# Altium schematic sheet Converter.SchDoc
size A4; SheetNumber: 2; SheetTotal: 4
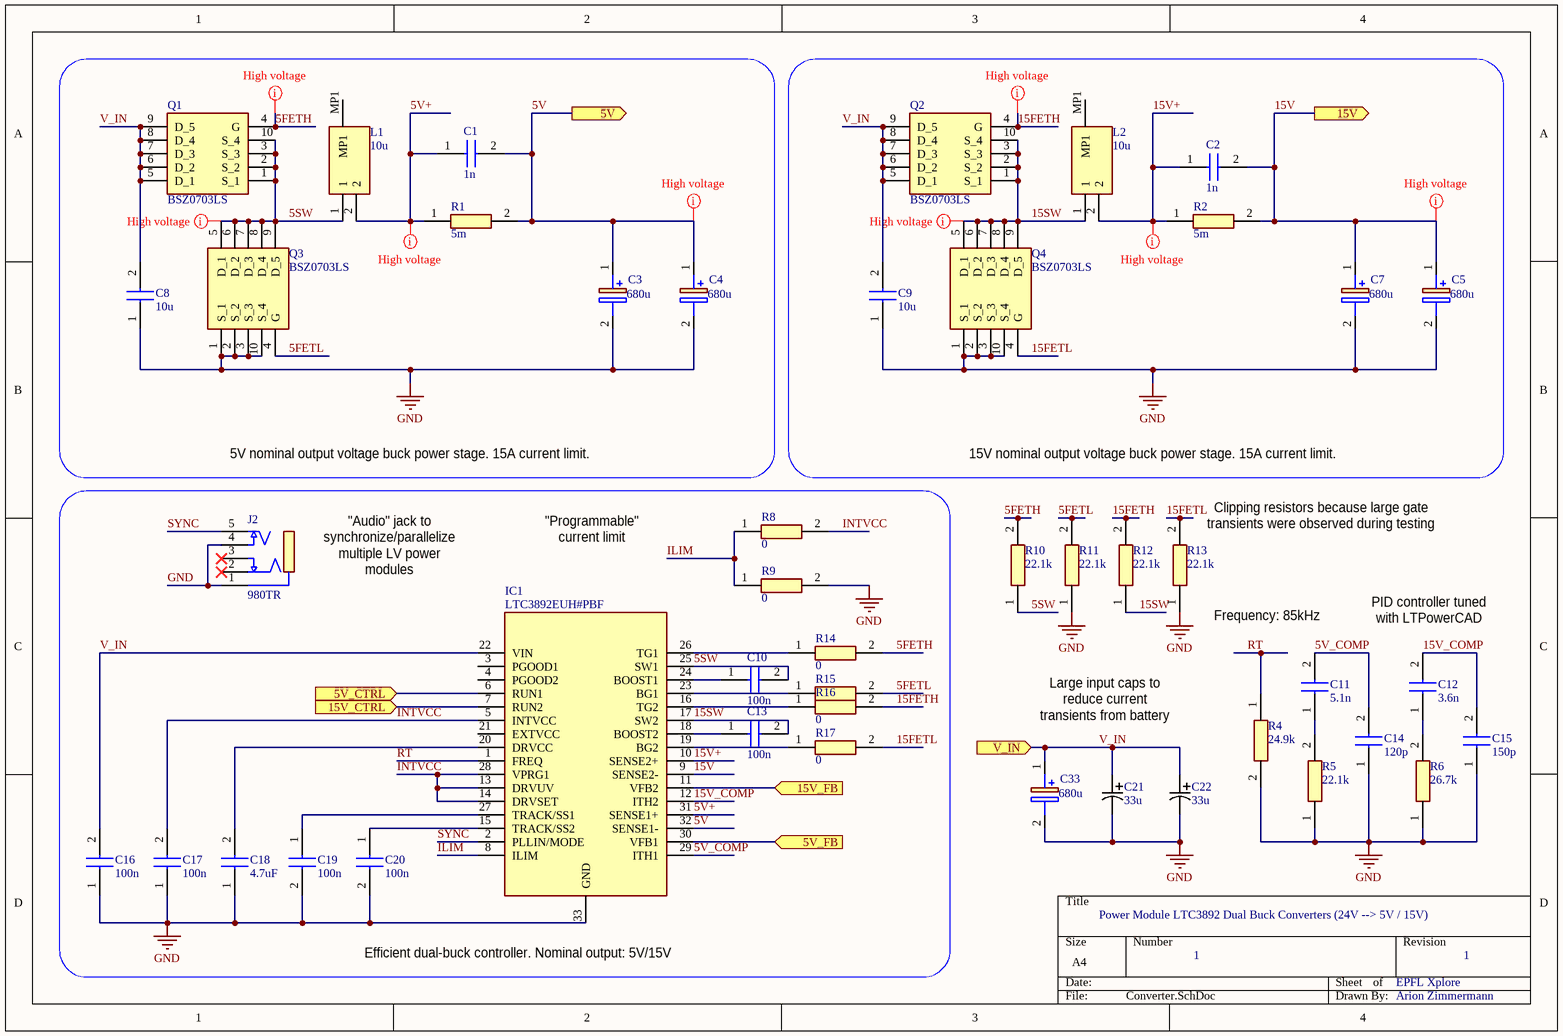
[diagram p0: Converter.SchDoc]

## Parts
C1  value 1n  [CAPC1608X95N]  (hidden comment: C0603C102J5RACTU)
C2  value 1n  [CAPC1608X95N]  (hidden comment: C0603C102J5RACTU)
C3  value 680u  [CAPPRD500W65D1000H1800]  (hidden comment: A750MW687M1VAAE018)
C4  value 680u  [CAPPRD500W65D1000H1800]  (hidden comment: A750MW687M1VAAE018)
C5  value 680u  [CAPPRD500W65D1000H1800]  (hidden comment: A750MW687M1VAAE018)
C7  value 680u  [CAPPRD500W65D1000H1800]  (hidden comment: A750MW687M1VAAE018)
C8  value 10u  [CAPC5750X310N]  (hidden comment: C5750X7S2A106K230KB)
C9  value 10u  [CAPC5750X310N]  (hidden comment: C5750X7S2A106K230KB)
C10  value 100n  [CAPC1608X95N]  (hidden comment: C0603C104K5RACTU)
C11  value 5.1n  [CAPC1608X87N]  (hidden comment: C0603C512J5GACAUTO)
C12  value 3.6n  [CAPC1608X87N]  (hidden comment: C0603C362J5GACTU)
C13  value 100n  [CAPC1608X95N]  (hidden comment: C0603C104K5RACTU)
C14  value 120p  [CAPC1608X87N]  (hidden comment: C0603C121J5GACTU)
C15  value 150p  [CAPC1608X87N]  (hidden comment: C0603C151J5GAC)
C16  value 100n  [CAPC1608X95N]  (hidden comment: C0603C104K5RACTU)
C17  value 100n  [CAPC1608X95N]  (hidden comment: C0603C104K5RACTU)
C18  value 4.7uF  [CAPC3316X195N]  (hidden comment: C1206X475M5RACAUTO)
C19  value 100n  [CAPC1608X95N]  (hidden comment: C0603C104K5RACTU)
C20  value 100n  [CAPC1608X95N]  (hidden comment: C0603C104K5RACTU)
C21  value 33u  [CAPMP7.6X4.3_3.1N_KEM]  (hidden comment: T598D336M035ATE065)
C22  value 33u  [CAPMP7.6X4.3_3.1N_KEM]  (hidden comment: T598D336M035ATE065)
C33  value 680u  [CAPPRD500W65D1000H1800]  (hidden comment: A750MW687M1VAAE018)
IC1  LTC3892EUH#PBF  [QFN50P500X500X80-33N-D]
J2  980TR  [980TR]
L1  value 10u  [PQ2614BLA1R0K]  (hidden comment: PQ2614BHA-100K)
L2  value 10u  [PQ2614BLA1R0K]  (hidden comment: PQ2614BHA-100K)
Q1  BSZ0703LS  [BSZ011NE2LS5IATMA1]
Q2  BSZ0703LS  [BSZ011NE2LS5IATMA1]
Q3  BSZ0703LS  [BSZ011NE2LS5IATMA1]
Q4  BSZ0703LS  [BSZ011NE2LS5IATMA1]
R1  value 5m  [RESC6432X80N]  (hidden comment: CRF2512-FZ-R005ELF)
R2  value 5m  [RESC6432X80N]  (hidden comment: CRF2512-FZ-R005ELF)
R4  value 24.9k  [RESC1608X50N]  (hidden comment: CRCW060324K9FKTA)
R5  value 22.1k  [RESC1608X50N]  (hidden comment: CRCW060322K1FKEB)
R6  value 26.7k  [RESC1608X50N]  (hidden comment: CRCW060326K7FKEB)
R8  Parameter 1: 0  [RESC1608X50N]  (hidden comment: CRCW06030000ZSTB)
R9  Parameter 1: 0  [RESC1608X50N]  (hidden comment: CRCW06030000ZSTB)
R10  value 22.1k  [RESC1608X50N]  (hidden comment: CRCW060322K1FKEB)
R11  value 22.1k  [RESC1608X50N]  (hidden comment: CRCW060322K1FKEB)
R12  value 22.1k  [RESC1608X50N]  (hidden comment: CRCW060322K1FKEB)
R13  value 22.1k  [RESC1608X50N]  (hidden comment: CRCW060322K1FKEB)
R14  Parameter 1: 0  [RESC1608X50N]  (hidden comment: CRCW06030000ZSTB)
R15  Parameter 1: 0  [RESC1608X50N]  (hidden comment: CRCW06030000ZSTB)
R16  Parameter 1: 0  [RESC1608X50N]  (hidden comment: CRCW06030000ZSTB)
R17  Parameter 1: 0  [RESC1608X50N]  (hidden comment: CRCW06030000ZSTB)

## Ports
5V (out), 5V_CTRL (in), 5V_FB (in), 15V (out), 15V_CTRL (in), 15V_FB (in), V_IN (in)

## Nets
GND: C3.2(-) C4.2(-) C5.2(-) C7.2(-) C8.1 C9.1 C14.1 C15.1 C16.1 C17.1 C18.1 C19.2 C20.2 C21.2 C22.2 C33.2(-) IC1.33(GND) J2.1 J2.4 Q3.1(S_1) Q3.2(S_2) Q3.3(S_3) Q3.10(S_4) Q4.1(S_1) Q4.2(S_2) Q4.3(S_3) Q4.10(S_4) R4.2 R5.1 R6.1 R9.2 R11.1 R13.1
5FETH: Q1.4(G) R10.2 R14.2
5FETL: Q3.4(G) R11.2 R15.2
5SW: C10.2 IC1.25(SW1) L1.1 Q1.1(S_1) Q1.2(S_2) Q1.3(S_3) Q1.10(S_4) Q3.5(D_1) Q3.6(D_2) Q3.7(D_3) Q3.8(D_4) Q3.9(D_5) R10.1
5V: C1.2 C3.1(+) C4.1(+) IC1.32(SENSE1-) R1.2 ; port 5V
5V+: C1.1 IC1.31(SENSE1+) L1.2 R1.1
5V_COMP: C11.2 C14.2 IC1.29(ITH1)
5V_CTRL: IC1.6(RUN1) ; port 5V_CTRL
5V_FB: IC1.30(VFB1) ; port 5V_FB
15FETH: Q2.4(G) R12.2 R16.2
15FETL: Q4.4(G) R13.2 R17.2
15SW: C13.2 IC1.17(SW2) L2.1 Q2.1(S_1) Q2.2(S_2) Q2.3(S_3) Q2.10(S_4) Q4.5(D_1) Q4.6(D_2) Q4.7(D_3) Q4.8(D_4) Q4.9(D_5) R12.1
15V: C2.2 C5.1(+) C7.1(+) IC1.9(SENSE2-) R2.2 ; port 15V
15V+: C2.1 IC1.10(SENSE2+) L2.2 R2.1
15V_COMP: C12.2 C15.2 IC1.12(ITH2)
15V_CTRL: IC1.7(RUN2) ; port 15V_CTRL
15V_FB: IC1.11(VFB2) ; port 15V_FB
ILIM: IC1.8(ILIM) R8.1 R9.1
INTVCC: C17.2 IC1.5(INTVCC) IC1.13(DRVUV) IC1.14(DRVSET) IC1.28(VPRG1) R8.2
RT: IC1.1(FREQ) R4.1
SYNC: IC1.2(PLLIN/MODE) J2.5
V_IN: C8.2 C9.2 C16.2 C21.1 C22.1 C33.1(+) IC1.22(VIN) Q1.5(D_1) Q1.6(D_2) Q1.7(D_3) Q1.8(D_4) Q1.9(D_5) Q2.5(D_1) Q2.6(D_2) Q2.7(D_3) Q2.8(D_4) Q2.9(D_5) ; port V_IN
NetC10_1: C10.1 IC1.24(BOOST1)
NetC11_1: C11.1 R5.2
NetC12_1: C12.1 R6.2
NetC13_1: C13.1 IC1.18(BOOST2)
NetC18_2: C18.2 IC1.20(DRVCC)
NetC19_1: C19.1 IC1.27(TRACK/SS1)
NetC20_1: C20.1 IC1.15(TRACK/SS2)
NetIC1_16: IC1.16(TG2) R16.1
NetIC1_19: IC1.19(BG2) R17.1
NetIC1_23: IC1.23(BG1) R15.1
NetIC1_26: IC1.26(TG1) R14.1

Not connected (* = marked no-connect by the designer): IC1 3(PGOOD1) 4(PGOOD2) 21(EXTVCC); J2 2* 3*; L1 MP1; L2 MP1

## Layout directives
net class HV2: 15V
net class HV1: 15V+
net class HV: 5FETH, 5SW, 15FETH, 15SW
net class HV3: 5V+
net class HV4: 5V

## Notes on the sheet
- 5V nominal output voltage buck power stage. 15A current limit.
- 15V nominal output voltage buck power stage. 15A current limit.
- (near R13) Clipping resistors because large gate transients were observed during testing
- "Audio" jack to synchronize/parallelize multiple LV power modules
- (near IC1) "Programmable" current limit
- (near R13) Frequency: 85kHz
- PID controller tuned with LTPowerCAD
- Large input caps to reduce current transients from battery
- Power Module LTC3892 Dual Buck Converters (24V --> 5V / 15V)
- (near IC1) Efficient dual-buck controller. Nominal output: 5V/15V
- 1
- EPFL Xplore
- Arion Zimmermann

## Library data of the parts
C1 C2 C10 C13 C16 C17 C19 C20 = C0603C104K5RACTU: Capacitor; Manufacturer_Name: Kemet; Datasheet Link: http://www.farnell.com/datasheets/2205446.pdf; Height: 0.95mm; Manufacturer_Part_Number: C0603C104K5RACTU; Mouser Part Number: 80-C0603C104K5R; Mouser Price/Stock: https://www.mouser.co.uk/ProductDetail/KEMET/C0603C104K5RACTU?qs=l5k%252BbMnNDkkVcnZPSAaaiQ%3D%3D; Arrow Part Number: C0603C104K5RACTU; Arrow Price/Stock: https://www.arrow.com/en/products/c0603c104k5ractu/kemet-corporation; Supplier 1: Mouser
  C1 C2: Supplier Part Number 1: 80-C0603C102J5R
  C10 C13 C16 C17 C19 C20: Supplier Part Number 1: 80-C0603C104K5R
C3-C5 C7 C33 = A750MW687M1VAAE018: Capacitor Polarised; Manufacturer_Name: Kemet; Datasheet Link: https://www.kemet.com/specsheet/A750MW687M1VAAE018; Height: 18mm; Manufacturer_Part_Number: A750MW687M1VAAE018
C8 C9 = C5750X7S2A106K230KB: Capacitor; Manufacturer_Name: TDK; Datasheet Link: http://www.mouser.com/ds/2/400/lcc_commercial_general_en-837201.pdf; Height: 3.1mm; Manufacturer_Part_Number: C5750X7S2A106K230KB; Arrow Part Number: C5750X7S2A106K230KB; Arrow Price/Stock: https://www.arrow.com/en/products/c5750x7s2a106k230kb/tdk; Mouser Part Number: 810-C5750X7S2A106KKB; Mouser Price/Stock: https://www.mouser.co.uk/ProductDetail/TDK/C5750X7S2A106K230KB?qs=XHchNesRtUZKzUEzha8N7w%3D%3D; Supplier 1: Mouser; Supplier Part Number 1: 810-C5750X7S2A106KKB
C11 = C0603C222J5RACAUTO: Capacitor; Manufacturer_Name: Kemet; Datasheet Link: https://api.kemet.com/component-edge/download/datasheet/C0603C222J5RACAUTO.pdf; Height: 0.87mm; Manufacturer_Part_Number: C0603C222J5RACAUTO; Mouser Part Number: 80-C0603C222J5RAUTO; Mouser Price/Stock: https://www.mouser.co.uk/ProductDetail/KEMET/C0603C222J5RACAUTO?qs=XYJIsZbdjSPu3wyG4zpZ%252Bg%3D%3D; Arrow Part Number: C0603C222J5RACAUTO; Arrow Price/Stock: https://www.arrow.com/en/products/c0603c222j5racauto/kemet-corporation; Supplier 1: Mouser; Supplier Part Number 1: 80-C0603C512J5GAUTO
C12 = C0603C102J5RACTU: Capacitor; Manufacturer_Name: Kemet; Datasheet Link: https://api.kemet.com/component-edge/download/datasheet/C0603C102J5RACTU.pdf; Height: 0.87mm; Manufacturer_Part_Number: C0603C102J5RACTU; Mouser Part Number: 80-C0603C102J5R; Mouser Price/Stock: https://www.mouser.co.uk/ProductDetail/KEMET/C0603C102J5RACTU?qs=qG1y%252BaZBm0ORyW8zMfKotw%3D%3D; Arrow Part Number: C0603C102J5RACTU; Arrow Price/Stock: https://www.arrow.com/en/products/c0603c102j5ractu/kemet-corporation; Supplier 1: Mouser; Supplier Part Number 1: 80-C0603C362J5G
C14 C15 = C0603C101J5RACTU: Capacitor; Manufacturer_Name: Kemet; Datasheet Link: https://componentsearchengine.com/Datasheets/1/C0603C101J5RACTU.pdf; Height: 0.87mm; Manufacturer_Part_Number: C0603C101J5RACTU; Mouser Part Number: 80-C0603C101J5R; Mouser Price/Stock: https://www.mouser.com/Search/Refine.aspx?Keyword=80-C0603C101J5R; Arrow Part Number: C0603C101J5RACTU; Arrow Price/Stock: https://www.arrow.com/en/products/c0603c101j5ractu/kemet-corporation; Supplier 1: Mouser
  C14: Supplier Part Number 1: 80-C0603C121J5G
  C15: Supplier Part Number 1: 80-C0603C151J5G
C18 = C1206X475M5RACAUTO: Capacitor; Manufacturer_Name: Kemet; Datasheet Link: https://www.kemet.com/specsheet/C1206X475M5RACAUTO; Height: 1.95mm; Manufacturer_Part_Number: C1206X475M5RACAUTO; Mouser Part Number: 80-C1206X475M5RAUTO; Mouser Price/Stock: https://www.mouser.co.uk/ProductDetail/KEMET/C1206X475M5RACAUTO?qs=%252B6g0mu59x7LXtOZABrHA3A%3D%3D; Supplier 1: Mouser; Supplier Part Number 1: 80-C1206X475M5RAUTO
C21 C22 = T598D336M035ATE065: No Description Available; Vendor: Kemet; SourceLibrary: Kemet_2020-03-25_3; Built_By: EMA_Frank; Source_Library: Kemet_2020-03-25_3.xlr; Type: DEV; Manufacturer_Part_Number: T598D336M035ATE065; Copyright: Copyright (C) 2018 Accelerated Designs. All rights reserved; RefDes: RefDes; Supplier 1: Mouser; Supplier Part Number 1: 80-T598D336M35E65
IC1 = LTC3892EUH#PBF: Integrated Circuit; Manufacturer_Name: Analog Devices; Datasheet Link: https://static6.arrow.com/aropdfconversion/d55dab638e5428544f7d993794f5b08548362f1a/25521248972647946369.pdf; Height: 0.8mm; Manufacturer_Part_Number: LTC3892EUH#PBF; Arrow Part Number: LTC3892EUH#PBF; Arrow Price/Stock: https://www.arrow.com/en/products/ltc3892euhpbf/analog-devices; Supplier 1: Mouser; Supplier Part Number 1: 584-LTC3892EUH-2#PBF
J2 = 980TR: Connector; Manufacturer_Name: Keystone Electronics; Datasheet Link: https://www.keyelco.com/product.cfm/product_id/2402; Height: 4.14mm; Manufacturer_Part_Number: 980TR; Mouser Part Number: 534-980; Mouser Price/Stock: https://www.mouser.co.uk/ProductDetail/Keystone-Electronics/980TR?qs=sOYabIlKNmdpbsH5J2zkLQ%3D%3D
L1 L2 = PQ2614BHA-100K: Inductor; Manufacturer_Name: Bourns; Datasheet Link: https://www.bourns.com/docs/Product-Datasheets/PQ2614.pdf; Height: 16mm; Manufacturer_Part_Number: PQ2614BHA-100K; Mouser Part Number: 652-PQ2614BHA-100K; Mouser Price/Stock: https://www.mouser.co.uk/ProductDetail/Bourns/PQ2614BHA-100K?qs=1mbolxNpo8cus7p6tzCJzA%3D%3D; Arrow Part Number: PQ2614BHA-100K; Arrow Price/Stock: https://www.arrow.com/en/products/pq2614bha-100k/bourns?region=nac; Supplier 1: Mouser; Supplier Part Number 1: 652-PQ2614BHA-100K
Q1-Q4 = BSZ011NE2LS5IATMA1: MOSFET (N-Channel); Manufacturer_Name: Infineon; Datasheet Link: https://componentsearchengine.com/Datasheets/1/BSZ011NE2LS5IATMA1.pdf; Height: 1.1mm; Manufacturer_Part_Number: BSZ011NE2LS5IATMA1; Mouser Part Number: 726-BSZ011NE2LS5IATM; Mouser Price/Stock: https://www.mouser.co.uk/ProductDetail/Infineon-Technologies/BSZ011NE2LS5IATMA1?qs=PzGy0jfpSMvXxmHh4MC9dw%3D%3D; Supplier 1: Mouser; Supplier Part Number 1: 726-BSZ0703LSATMA1
R1 R2 = CRF2512-FZ-R005ELF: Resistor; Manufacturer_Name: Bourns; Datasheet Link: https://www.arrow.com/en/products/crf2512-fz-r005elf/bourns; Height: 0.8mm; Manufacturer_Part_Number: CRF2512-FZ-R005ELF; Mouser Part Number: 652-CRF2512FZR005ELF; Mouser Price/Stock: https://www.mouser.co.uk/ProductDetail/Bourns/CRF2512-FZ-R005ELF/?qs=iHX4uCgIbgMqZUuYK4Zqgg%3D%3D; Arrow Part Number: CRF2512-FZ-R005ELF; Arrow Price/Stock: https://www.arrow.com/en/products/crf2512-fz-r005elf/bourns; Supplier 1: Mouser; Supplier Part Number 1: 652-CRF2512FZR005ELF
R4 = CRCW060324K9FKEA: Resistor; Manufacturer_Name: Vishay; Datasheet Link: http://www.vishay.com/docs/20035/dcrcwe3.pdf; Height: 0.5mm; Manufacturer_Part_Number: CRCW060324K9FKEA; Mouser Part Number: 71-CRCW0603-24.9K-E3; Mouser Price/Stock: https://www.mouser.co.uk/ProductDetail/Vishay-Dale/CRCW060324K9FKEA?qs=duauLwvczSYlbxc75y0kVA%3D%3D; Arrow Part Number: CRCW060324K9FKEA; Arrow Price/Stock: https://www.arrow.com/en/products/crcw060324k9fkea/vishay; Supplier 1: Mouser; Supplier Part Number 1: 71-CRCW0603-24.9K
R5 R10-R13 = CRCW06037K50FKEB: Resistor; Manufacturer_Name: Vishay; Datasheet Link: http://www.vishay.com/docs/20035/dcrcwe3.pdf; Height: 0.5mm; Manufacturer_Part_Number: CRCW06037K50FKEB; Mouser Part Number: 71-CRCW06037K50FKEB; Mouser Price/Stock: https://www.mouser.co.uk/ProductDetail/Vishay-Dale/CRCW06037K50FKEB?qs=2ihuRUavkaTvW2vO4EimMQ%3D%3D; Supplier 1: Mouser; Supplier Part Number 1: 71-CRCW060322K1FKEB
R6 = CRCW060334K0FKEA: Resistor; Manufacturer_Name: Vishay; Datasheet Link: http://www.vishay.com/docs/20035/dcrcwe3.pdf; Height: 0.5mm; Manufacturer_Part_Number: CRCW060334K0FKEA; Mouser Part Number: 71-CRCW0603-34K-E3; Mouser Price/Stock: https://www.mouser.com/Search/Refine.aspx?Keyword=71-CRCW0603-34K-E3; Arrow Part Number: CRCW060334K0FKEA; Arrow Price/Stock: https://www.arrow.com/en/products/crcw060334k0fkea/vishay; Supplier 1: Mouser; Supplier Part Number 1: 71-CRCW060326K7FKEB
R8 R9 R14-R17 = CRCW06030000ZSTB: Resistor; Manufacturer_Name: Vishay; Datasheet Link: http://www.vishay.com/docs/20035/dcrcwe3.pdf; Height: 0.5mm; Manufacturer_Part_Number: CRCW06030000ZSTB; Mouser Part Number: 71-CRCW0603000ZT-RT5; Mouser Price/Stock: https://www.mouser.co.uk/ProductDetail/Vishay-Dale/CRCW06030000ZSTB?qs=2ymmDbJkxOjBfbAlbZJVUA%3D%3D; Arrow Part Number: CRCW06030000ZSTB; Arrow Price/Stock: https://www.arrow.com/en/products/crcw06030000zstb/vishay?region=nac; Supplier 1: Mouser; Supplier Part Number 1: 71-CRCW0603000ZT-RT5